# Altium schematic sheet onThyristor.SchDoc
size A4
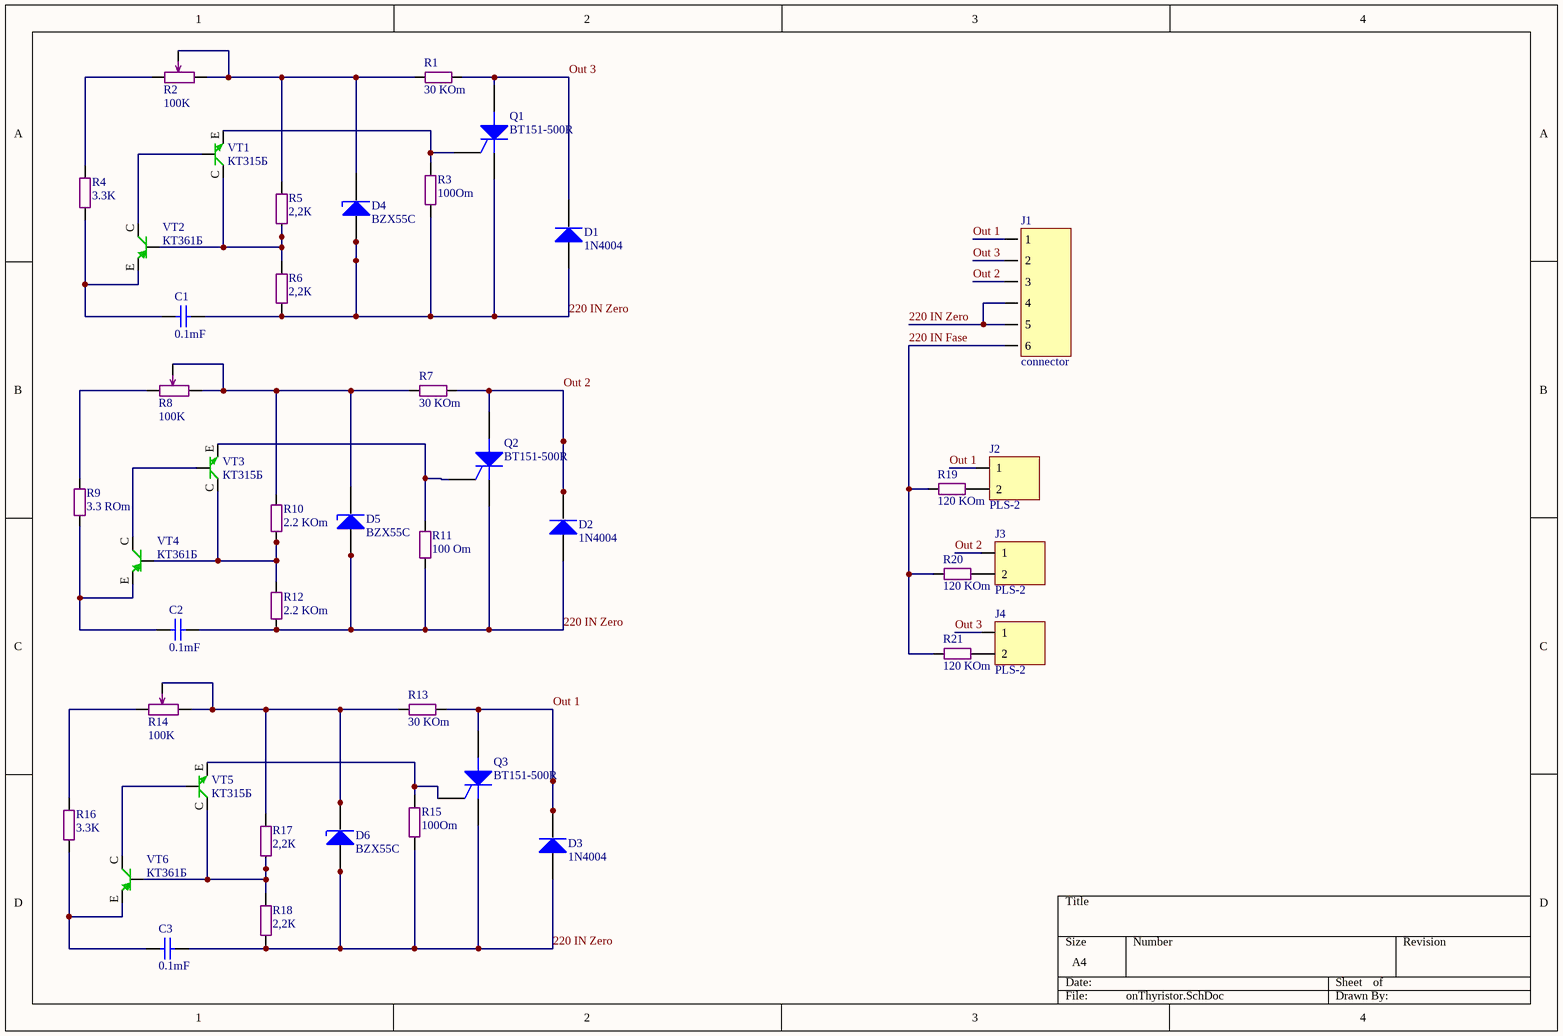
[diagram p0: onThyristor.SchDoc]

## Parts
C1  0.1mF  [Cap P5.08MM (3p) disk2]
C2  0.1mF  [Cap P5.08MM (3p) disk2]
C3  0.1mF  [Cap P5.08MM (3p) disk2]
D1  1N4004  [Diode DO-35]
D2  1N4004  [Diode DO-35]
D3  1N4004  [Diode DO-35]
D4  BZX55C  [Diode DO-35]
D5  BZX55C  [Diode DO-35]
D6  BZX55C  [Diode DO-35]
J1  connector  [Molex Mini-Fit Jr - 6Pin R]
J2  PLS-2  [Line 2.54 x 2]
J3  PLS-2  [Line 2.54 x 2]
J4  PLS-2  [Line 2.54 x 2]
Q1  BT151-500R  [TO220-2]
Q2  BT151-500R  [TO220-2]
Q3  BT151-500R  [TO220-2]
R1  30 KOm  [Res 5W L22mm, p30mm]
R2  100K  [PinLine 3x]
R3  100Om  [Res p7.62 (4p) 0.25w]
R4  3.3K  [Res p7.62 (4p) 0.25w]
R5  2,2К  [Res p7.62 (4p) 0.25w]
R6  2,2К  [Res p7.62 (4p) 0.25w]
R7  30 KOm  [Res 5W L22mm, p30mm]
R8  100K  [PinLine 3x]
R9  3.3 ROm  [Res p7.62 (4p) 0.25w]
R10  2.2 KOm  [Res p7.62 (4p) 0.25w]
R11  100 Om  [Res p7.62 (4p) 0.25w]
R12  2.2 KOm  [Res p7.62 (4p) 0.25w]
R13  30 KOm  [Res 5W L22mm, p30mm]
R14  100K  [PinLine 3x]
R15  100Om  [SMD 0805 (2012)]
R16  3.3K  [Res p7.62 (4p) 0.25w]
R17  2,2К  [Res p7.62 (4p) 0.25w]
R18  2,2К  [Res p7.62 (4p)]
R19  120 KOm  [SMD 1206 (3216)]
R20  120 KOm  [SMD 1206 (3216)]
R21  120 KOm  [SMD 1206 (3216)]
VT1  КТ315Б  [Trnstr (3p) ECB]
VT2  КТ361Б  [Trnstr (3p) ECB]
VT3  КТ315Б  [Trnstr (3p) ECB]
VT4  КТ361Б  [Trnstr (3p) ECB]
VT5  КТ315Б  [Trnstr (3p) ECB]
VT6  КТ361Б  [Trnstr (3p) ECB]

## Nets
220 IN Fase: J1.6 R19.1 R20.1 R21.1
220 IN Zero: C1.2 C2.2 C3.2 D1.A D2.A D3.A D4.A D5.A D6.A J1.4 J1.5 Q1.1(K) Q2.1(K) Q3.1(K) R3.1 R6.1 R11.1 R12.1 R15.1 R18.1
Out 1: D3.K J1.1 J2.1 Q3.2(A) R13.2
Out 2: D2.K J1.3 J3.1 Q2.2(A) R7.2
Out 3: D1.K J1.2 J4.1 Q1.2(A) R1.2
NetC1_1: C1.1 R4.1 VT2.E
NetC2_1: C2.1 R9.1 VT4.E
NetC3_1: C3.1 R16.1 VT6.E
NetD4_K: D4.K R1.1 R2.2 R2.3 R5.2
NetD5_K: D5.K R7.1 R8.2 R8.3 R10.2
NetD6_K: D6.K R13.1 R14.2 R14.3 R17.2
NetJ2_2: J2.2 R19.2
NetJ3_2: J3.2 R20.2
NetJ4_2: J4.2 R21.2
NetQ1_3: Q1.3(G) R3.2 VT1.E
NetQ2_3: Q2.3(G) R11.2 VT3.E
NetQ3_3: Q3.3(G) R15.2 VT5.E
NetR2_1: R2.1 R4.2
NetR5_1: R5.1 R6.2 VT1.C VT2.B
NetR8_1: R8.1 R9.2
NetR10_1: R10.1 R12.2 VT3.C VT4.B
NetR14_1: R14.1 R16.2
NetR17_1: R17.1 R18.2 VT5.C VT6.B
NetVT1_B: VT1.B VT2.C
NetVT3_B: VT3.B VT4.C
NetVT5_B: VT5.B VT6.C

## Library data of the parts
C1-C3 = Cap Ceramic: Capacitor
D1-D3 = Diode 1N4004: 1 Amp General Purpose Rectifier; PackageReference: DO-41; PackageDescription: Diode, Axial; Body 5.2 x 2.7 mm (LxDia. max), Lead Dia. 0.86 mm (max); Code_JEDEC: DO-204-AL; ComponentLink1Description: Manufacturer Link; ComponentLink1URL: http://www.fairchildsemi.com/; ComponentLink2Description: Datasheet; ComponentLink2URL: http://www.fairchildsemi.com/ds/1N%2F1N4001.pdf; VALUE: 1N4004
D4-D6 = Stabistor BZX55C: 1 Amp General Purpose Rectifier; Power Dissipation: 500 mW; Thermal Resistance  Junction to Ambient: 0.3 K/mW; Forward Voltage @IF= 100mA: 1.0 V; VZ Tolerance: 5 %; Zener Voltage: 10 V; PackageReference: DO-35; VALUE: BZX55C; DataSheet: http://rectron.apls.ru/assets/images/pdf/bzx55c.pdf
J1 = Molex Mini-Fit Jr - 6 pin - R: Right, Dbl line, Female
J2-J4 = PLS-2: Vert, Sgl line, Male
Q1-Q3 = Th BT151-500R: Thyristor; I: 7.5A; U Rev Max: 500V; PackageReference: TO-220-AB; Code_JEDEC: TO-220-AB; Name: BT151-500R
R1 R7 R13 = Res 5W: 5W Cement
R2 R8 R14 = Resistor Adj
R3-R6 R15-R18 = Resistor
R9-R12 = Res SMD 0603
R19-R21 = Res Carbon
VT1 VT3 VT5 = NPN
VT2 VT4 VT6 = PNP